# Altium schematic sheet MDBT42Q - Copy.SchDoc
size A3 portrait
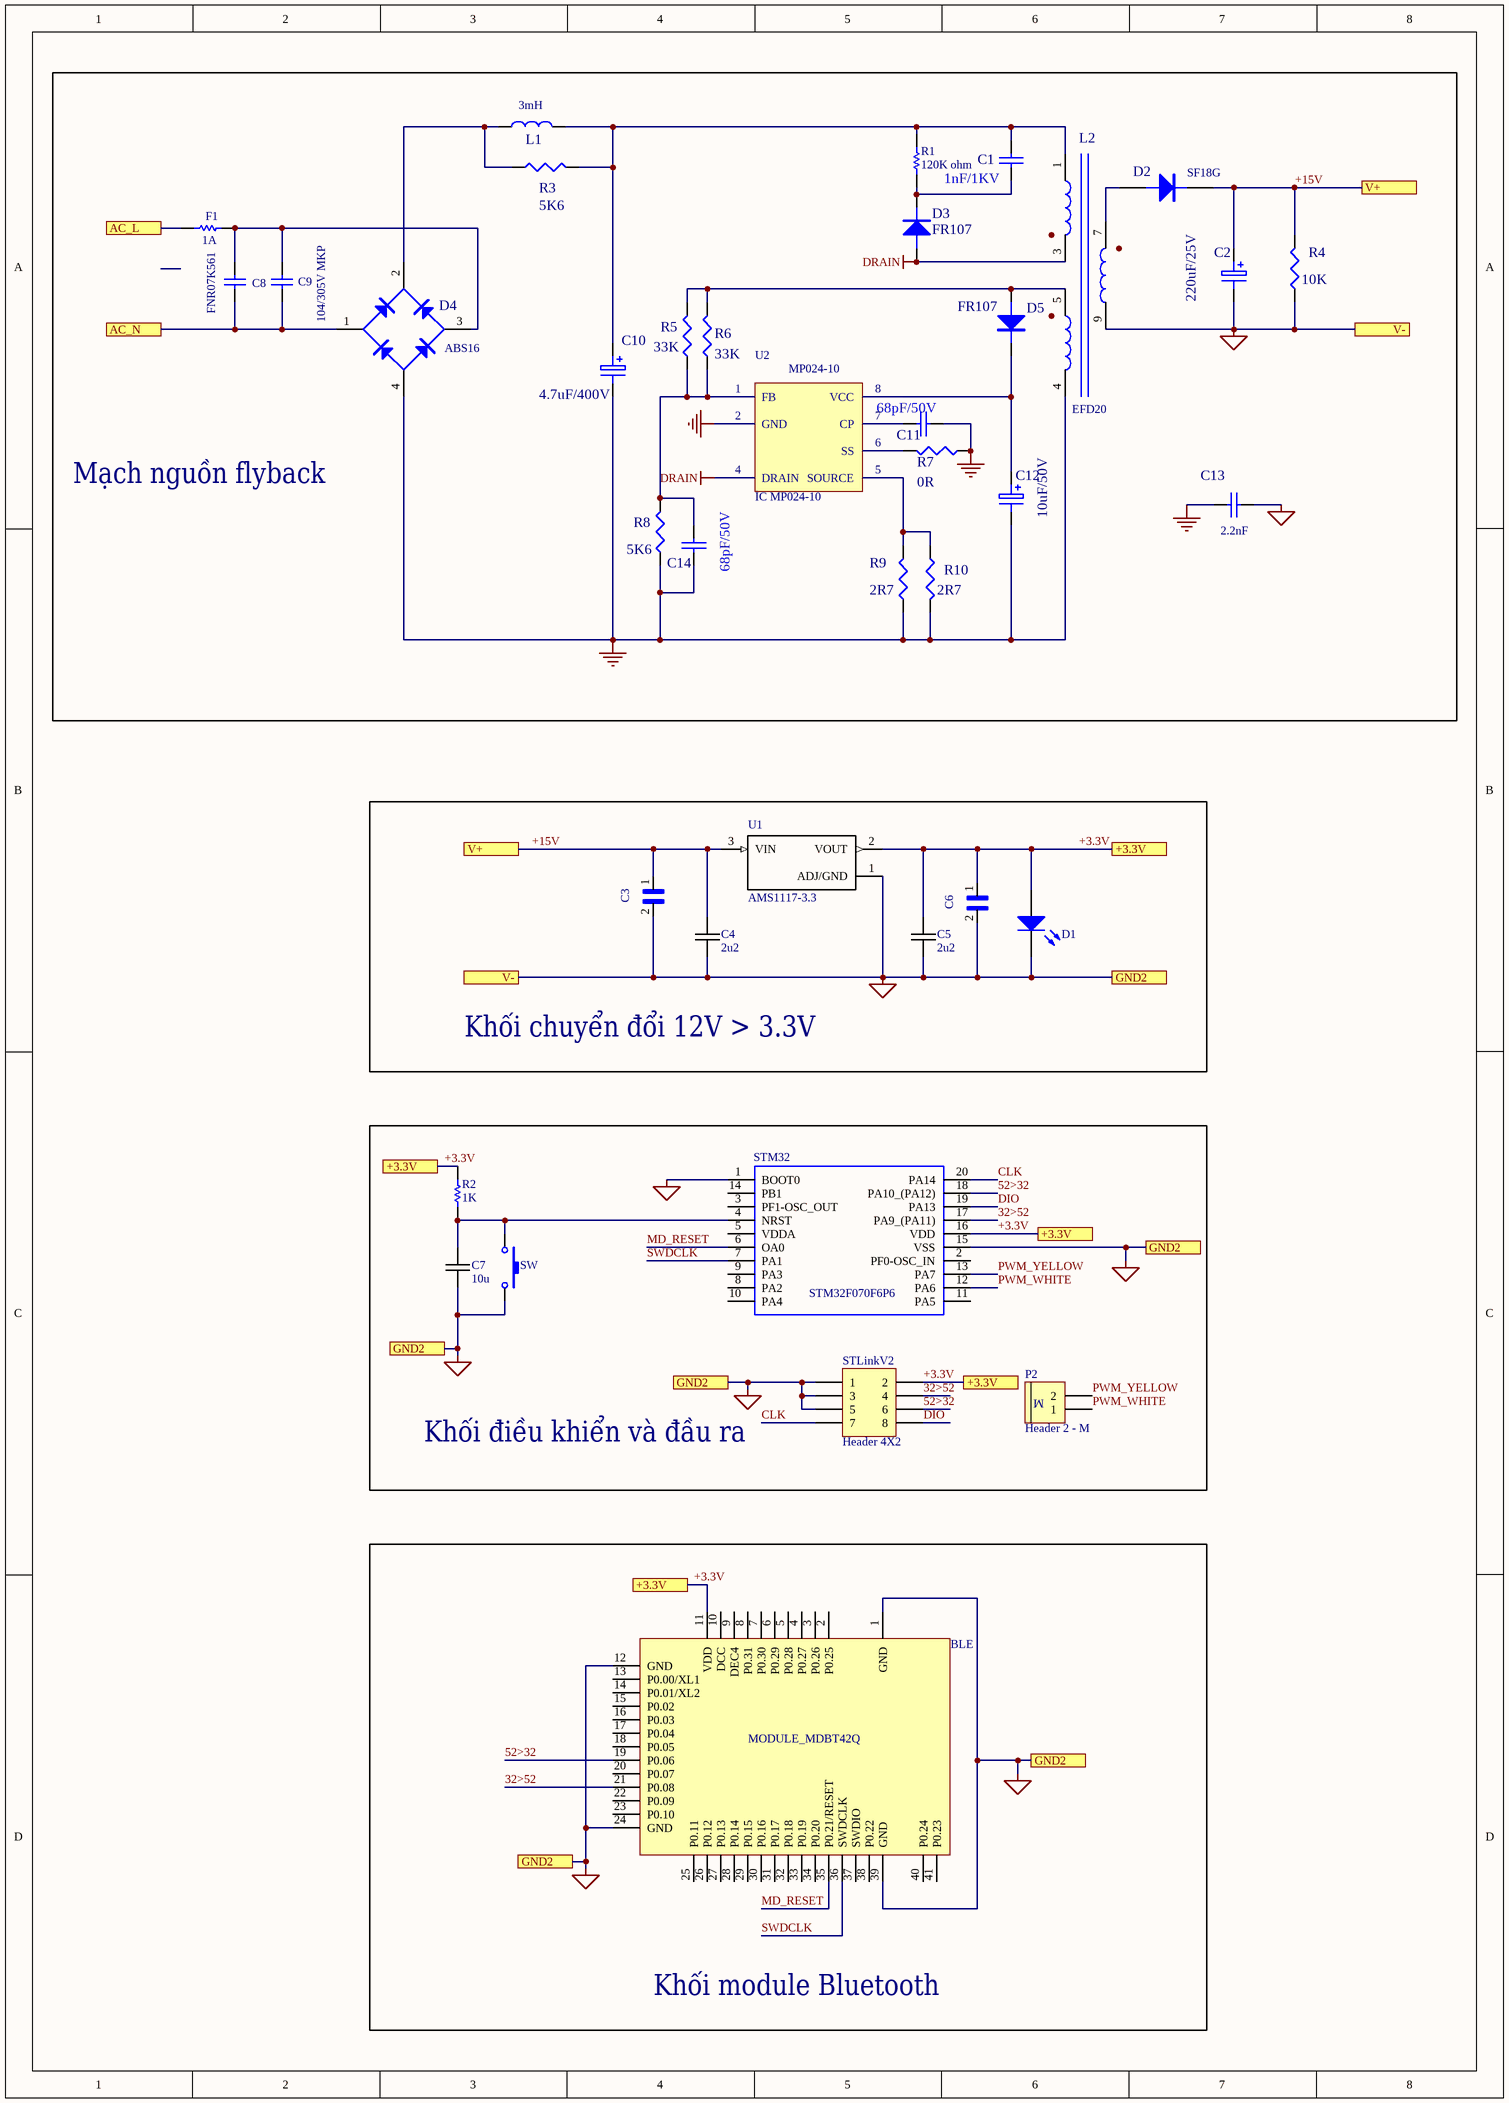
[diagram p0: MDBT42Q - Copy.SchDoc]

## Parts
BLE  MODULE_MDBT42Q  [PCB_MDBT42Q_10X16]
C1  1nF/1KV  [1nF/1KV]
C2  220uF/25V  [220uF/25V]
C3  C3216X5R1A106K160AB  [CAPC3216X180]  (value not drawn)
C4  2u2  [0805C-GENERIC]
C5  2u2  [0805C-GENERIC]
C6  C3216X5R1A106K160AB  [CAPC3216X180]  (value not drawn)
C7  10u  [0805C-GENERIC]
C8  FNR07K561  [FNR07K561]
C9  104/305V MKP  [104/305V MKP]
C10  4.7uF/400V  [4.7uF/400V]
C11  68pF/50V  [Cap_X]
C12  10uF/50V  [10uF/50V]
C13  2.2nF  [CAP ISOLATOR]
C14  68pF/50V  [Cap_X]
D1  LED SMD  [LED_0805_Blue]  (value not drawn)
D2  SF18G  [SF18G]
D3  FR107  [FR107]
D4  ABS16  [ABS16]
D5  FR107  [RF107 dung]
F1  1A  [Cau chi hop 1A]
L1  3mH  [INDUCTOR_x]
L2  EFD20  [MBA-9]
P2  Header 2 - M  [Medium - Header 2]
R1  120K ohm  [R1W dung]
R2  value 1K  [RES-SM-1206]  (hidden comment: RESISTOR SMD)
R3  5K6  [RES_X]
R4  10K  [RES_X]
R5  33K  [RES_X]
R6  33K  [RES_X]
R7  0R  [RES_X]
R8  5K6  [RES_X]
R9  2R7  [RES_X]
R10  2R7  [RES_X]
STLinkV2  Header 4X2  [HDR2X4]
STM32  STM32F070F6P6  [SOP65P640X120-20N]
SW  SW-SMD  [SW-SMD]  (value not drawn)
U1  AMS1117-3.3  [SOT229P700X180-4N]
U2  IC MP024-10  [MP024-10]

## Blocks framed on the sheet
Mạch nguồn flyback: C1 C2 C8-C14 D2-D5 F1 L1 L2 R1 R3-R10 U2
Khối chuyển đổi 12V > 3.3V: C3-C6 D1 U1
Khối điều khiển và đầu ra: C7 P2 R2 STLinkV2 STM32 SW
Khối module Bluetooth: BLE

## Ports
+3.3V, AC_L, AC_N, GND2, V+, V-

## Nets
DRAIN: D3.1(A) L2.3 U2.4(DRAIN)
GND: C10.2 C11.2 C12.2 C13.1 C14.2 D4.4(V-) L2.4 R7.2 R8.2 R9.1 R10.2 U2.2(GND)
GND2: BLE.1(GND) BLE.12(GND) BLE.24(GND) BLE.39(GND) C2.2 C3.2 C4.2 C5.2 C6.2 C7.2 C13.2 D1.2(K) L2.9(B) R4.1 STLinkV2.1 STLinkV2.3 STLinkV2.5 STM32.1(BOOT0) STM32.15(VSS) SW.2 U1.1(ADJ/GND) ; port V-, port GND2
32>52: BLE.21(P0.08) STLinkV2.4 STM32.17(PA9_(PA11))
52>32: BLE.19(P0.06) STLinkV2.6 STM32.18(PA10_(PA12))
+3.3V: BLE.11(VDD) C5.1 C6.1 D1.1(A) R2.2 STLinkV2.2 STM32.16(VDD) U1.2(VOUT) ; port +3.3V
+15V: C2.1 C3.1 C4.1 D2.2(K) R4.2 U1.3(VIN) ; port V+
AC_L: F1.2 ; port AC_L
AC_N: C8.2 C9.2 D4.1(AC) ; port AC_N
CLK: STLinkV2.7 STM32.20(PA14)
DIO: STLinkV2.8 STM32.19(PA13)
MD_RESET: BLE.35(P0.21/RESET) STM32.6(OA0)
PWM_WHITE: P2.1 STM32.12(PA6)
PWM_YELLOW: P2.2 STM32.13(PA7)
SWDCLK: BLE.36(SWDCLK) STM32.7(PA1)
NetC1_1: C1.1 C10.1 L1.2 L2.1 R1.2 R3.2
NetC1_2: C1.2 D3.2(K) R1.1
NetC7_1: C7.1 R2.1 STM32.4(NRST) SW.1
NetC8_1: C8.1 C9.1 D4.3(AC) F1.1
NetC11_1: C11.1 U2.7(CP)
NetC12_1: C12.1 D5.2(K) U2.8(VCC)
NetC14_1: C14.1 R5.2 R6.2 R8.1 U2.1(FB)
NetD2_1: D2.1(A) L2.7(A)
NetD4_2: D4.2(V+) L1.1 R3.1
NetD5_1: D5.1(A) L2.5 R5.1 R6.1
NetR7_1: R7.1 U2.6(SS)
NetR9_2: R9.2 R10.1 U2.5(SOURCE)

Not connected (* = marked no-connect by the designer): BLE 2(P0.25) 3(P0.26) 4(P0.27) 5(P0.28) 6(P0.29) 7(P0.30) 8(P0.31) 9(DEC4) 10(DCC) 13(P0.00/XL1) 14(P0.01/XL2) 15(P0.02) 16(P0.03) 17(P0.04) 18(P0.05) 20(P0.07) 22(P0.09) 23(P0.10) 25(P0.11) 26(P0.12) 27(P0.13) 28(P0.14) 29(P0.15) 30(P0.16) 31(P0.17) 32(P0.18) 33(P0.19) 34(P0.20) 37(SWDIO) 38(P0.22) 40(P0.24) 41(P0.23); STM32 2(PF0-OSC_IN) 3(PF1-OSC_OUT) 5(VDDA) 8(PA2) 9(PA3) 10(PA4) 11(PA5) 14(PB1)

## Notes on the sheet
- (in symbol Header 2 - M) M
- (in symbol IC MP024-10) MP024-10

## Library data of the parts
BLE = MODULE_MDBT42Q: MDBT42Q
C1 C11 C13 C14 = CAP: Capacitor
C2 C10 C12 = ELECTRO0
C3 = C3216X5R1A106K160AB: C Series 1206 10 uF 10 V Â±10 % Tolerance X5R SMT Multilayer Ceramic Capacitor. Tụ Tantalium; MF: TDK; SnapEDA_Link: https://www.snapeda.com/parts/C3216X5R1A106K160AB/TDK/view-part/?ref=snap; Availability: Unavailable; Price: 0.19 USD; Package: 1206 TDK; MP: C3216X5R1A106K160AB; Value: *
C4 C5 C7 = 0805C-2U2-6V3-X5R-PAN: CAPACITOR 0805 CERAMIC; Manufacturer Part Number: ECJ-1VB0J225K; Manufacturer: Panasonic - ECG; Reel: C7; Supplier 1: Digi-Key; Supplier Part Number 1: PCC2273TR-ND
C6 = C3216X5R1A106K160AB: C Series 1206 10 uF 10 V Â±10 % Tolerance X5R SMT Multilayer Ceramic Capacitor; MF: TDK; SnapEDA_Link: https://www.snapeda.com/parts/C3216X5R1A106K160AB/TDK/view-part/?ref=snap; Availability: Unavailable; Price: 0.19 USD; Package: 1206 TDK; MP: C3216X5R1A106K160AB; Value: *
C8 C9 = Cap: Capacitor
D1 = LED SMD: LED
D2 = DIODE
D3 D5 = DIODE0
D4 = BRIDGE1: Diode Bridge
F1 = Res: Resistor
L1 = INDUCTOR1
L2 = TRANS-EE
P2 = Header 2 - M: Header, 2-Pin, Medium; LatestRevisionDate: 17-Jul-2002; LatestRevisionNote: Re-released for DXP Platform.; Publisher: Altium Limited
R1 = RESC: Resistor; Value: 1K
R2 = RESISTOR SMD: Resistor
R3-R10 = RES1A
STLinkV2 = Header 4X2: Header, 4-Pin, Dual row; LatestRevisionDate: 17-Jul-2002; LatestRevisionNote: Re-released for DXP Platform.; Publisher: Altium Limited
STM32 = STM32F070F6P6: STMICROELECTRONICS - STM32F070F6P6 - MCU, 32BIT, CORTEX-M0, 48MHZ, TSSOP-20; Geometry.Height: 1.2mm; Manufacturer_Name: STMicroelectronics; Manufacturer_Part_Number: STM32F070F6P6; RS Part Number: *; RS Price/Stock: *; Arrow Part Number: STM32F070F6P6; Arrow Price/Stock: https://www.arrow.com/en/products/stm32f070f6p6/stmicroelectronics; Datasheet Link: http://www.st.com/content/ccc/resource/technical/document/datasheet/31/4f/10/5f/a5/32/46/42/DM00141386.pdf/files/DM00141386.pdf/jcr:content/translations/en.DM00141386.pdf
SW = SW-SMD: Switch; Published: 24-Mar-1999; LatestRevisionDate: 17-Jul-2002; LatestRevisionNote: Re-released for DXP Platform.; PackageReference: SPST-2; Publisher: Altium Limited
U1 = AMS1117-3.3: Sot223/Pkg 1-Amp 3.3-Volt Low Drop Out Voltage Regulatator; MF: Advanced Monolithic Systems; SnapEDA_Link: https://www.snapeda.com/parts/AMS1117-3.3/Advanced%20Monolithic%20Systems/view-part/?ref=snap; Availability: Unavailable; MP: AMS1117-3.3; Price: None; Package: None; Value: *